# EAGLE schematic untitled (EAGLE 9.3.0)

## Sheet 1 of 4
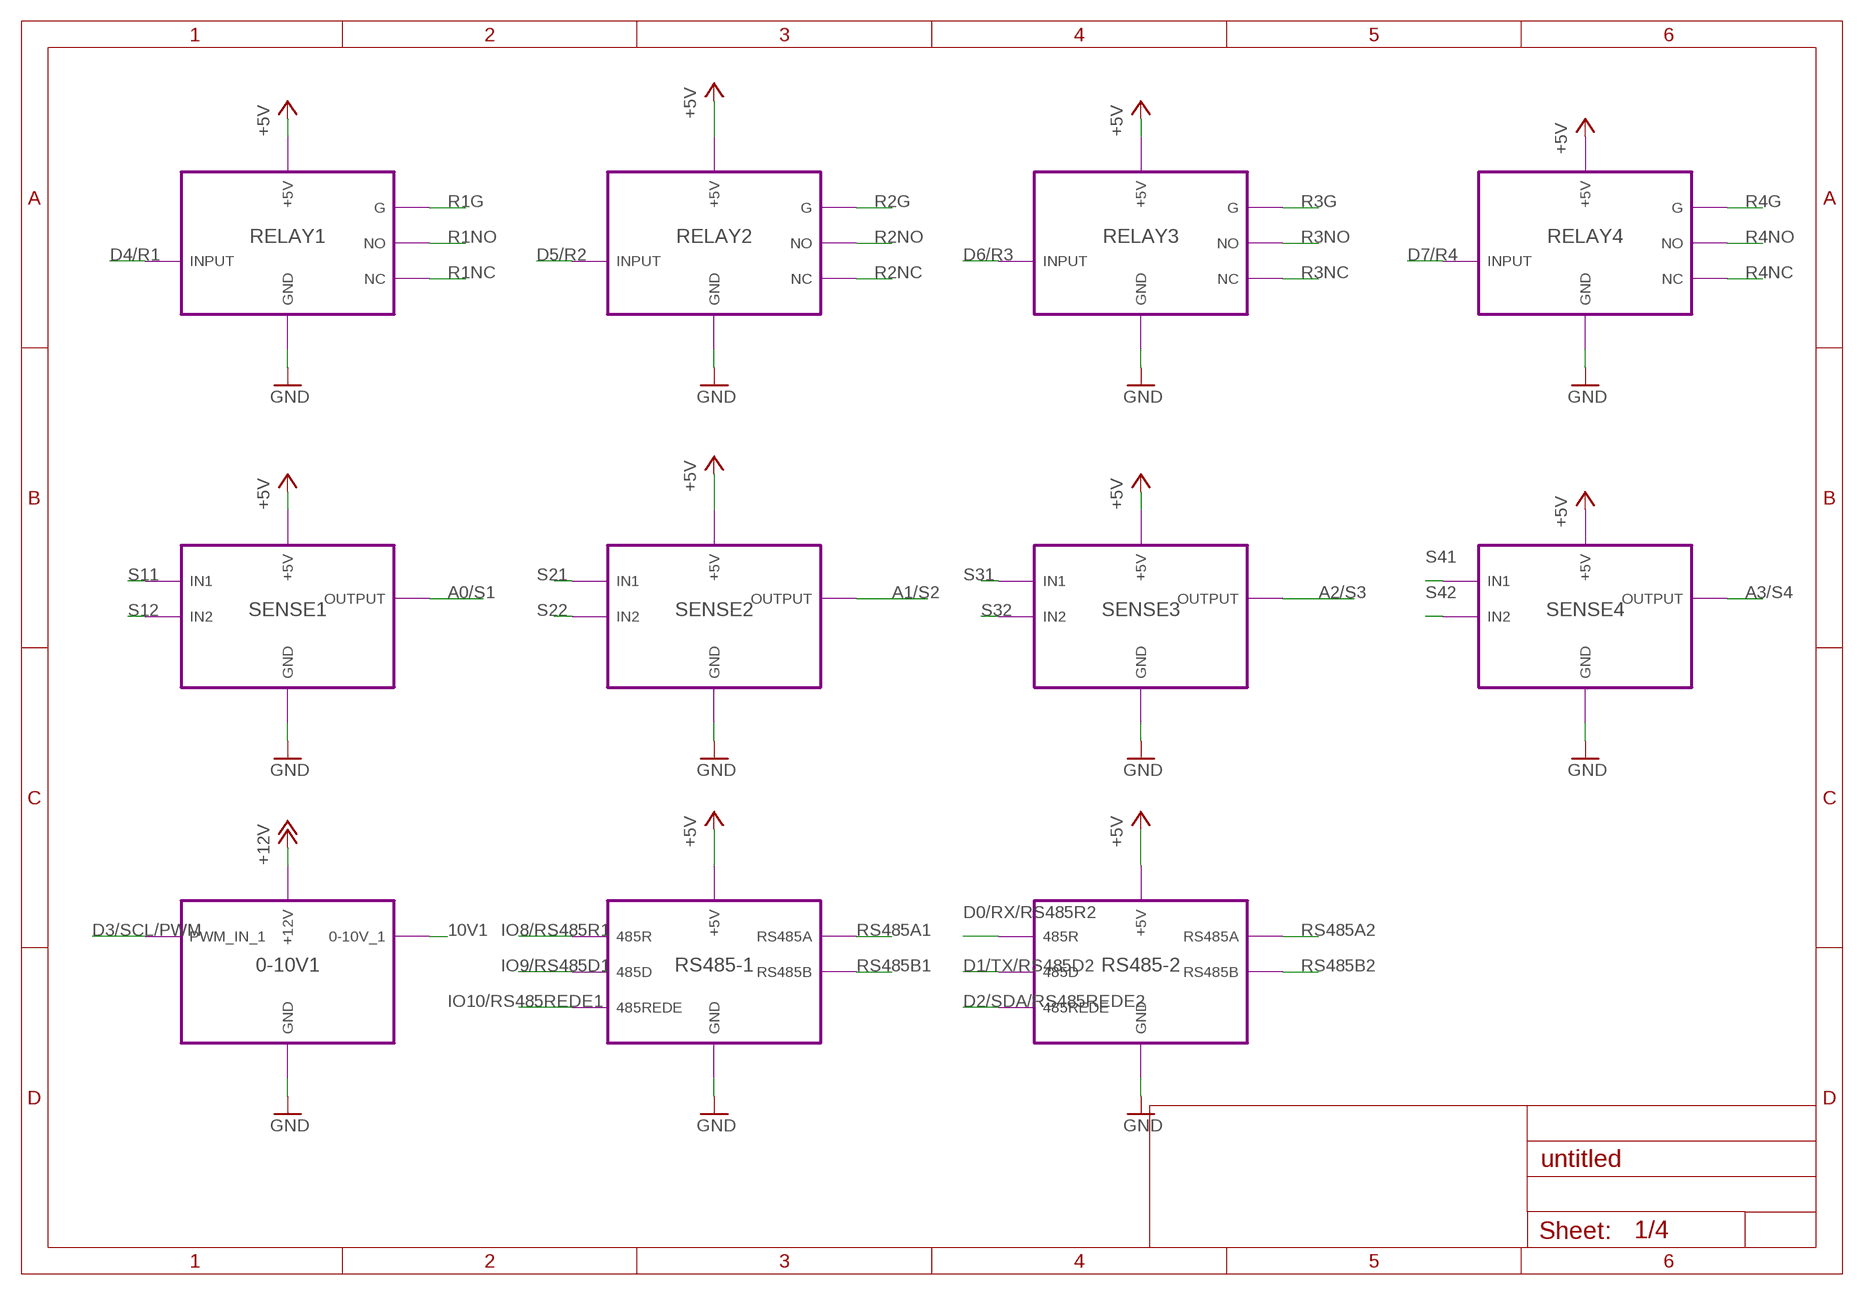
[diagram p0: schematic, sheet 1]

### Module instances
RELAY1 = RELAY (part numbers offset by 100)
RELAY2 = RELAY (part numbers offset by 200)
RELAY3 = RELAY (part numbers offset by 300)
RELAY4 = RELAY (part numbers offset by 400)
SENSE1 = SENSE (part numbers offset by 500)
SENSE2 = SENSE (part numbers offset by 600)
SENSE3 = SENSE (part numbers offset by 700)
SENSE4 = SENSE (part numbers offset by 800)
0-10V1 = 0-10V (part numbers offset by 900)
RS485-1 = RS485 (part numbers offset by 1000)
RS485-2 = RS485 (part numbers offset by 1100)

### Nets
10V1: port 0-10V1.0-10V_1 ; also sheet 4
+5V [power]: port RELAY1.+5V RELAY2.+5V RELAY3.+5V RELAY4.+5V SENSE1.+5V SENSE2.+5V SENSE3.+5V SENSE4.+5V RS485-1.+5V RS485-2.+5V ; also sheet 2,3,4
+12V [power]: port 0-10V1.+12V ; also sheet 3
A0/S1: port SENSE1.OUTPUT ; also sheet 2
A1/S2: port SENSE2.OUTPUT ; also sheet 2
A2/S3: port SENSE3.OUTPUT ; also sheet 2
A3/S4: port SENSE4.OUTPUT ; also sheet 2
D0/RX/RS485R2: port RS485-2.485R ; also sheet 2
D1/TX/RS485D2: port RS485-2.485D ; also sheet 2
D2/SDA/RS485REDE2: port RS485-2.485REDE ; also sheet 2
D3/SCL/PWM: port 0-10V1.PWM_IN_1 ; also sheet 2
D4/R1: port RELAY1.INPUT ; also sheet 2
D5/R2: port RELAY2.INPUT ; also sheet 2
D6/R3: port RELAY3.INPUT ; also sheet 2
D7/R4: port RELAY4.INPUT ; also sheet 2
GND [power]: port RELAY1.GND RELAY2.GND RELAY3.GND RELAY4.GND SENSE1.GND SENSE2.GND SENSE3.GND SENSE4.GND 0-10V1.GND RS485-1.GND RS485-2.GND ; also sheet 2,3,4
IO8/RS485R1: port RS485-1.485R ; also sheet 2
IO9/RS485D1: port RS485-1.485D ; also sheet 2
IO10/RS485REDE1: port RS485-1.485REDE ; also sheet 2
R1G [hipower]: port RELAY1.G ; also sheet 4
R1NC: port RELAY1.NC ; also sheet 4
R1NO [hipower]: port RELAY1.NO ; also sheet 4
R2G [hipower]: port RELAY2.G ; also sheet 4
R2NC [hipower]: port RELAY2.NC ; also sheet 4
R2NO [hipower]: port RELAY2.NO ; also sheet 4
R3G [hipower]: port RELAY3.G ; also sheet 4
R3NC [hipower]: port RELAY3.NC ; also sheet 4
R3NO [hipower]: port RELAY3.NO ; also sheet 4
R4G [hipower]: port RELAY4.G ; also sheet 4
R4NC [hipower]: port RELAY4.NC ; also sheet 4
R4NO [hipower]: port RELAY4.NO ; also sheet 4
RS485A1: port RS485-1.RS485A ; also sheet 4
RS485A2: port RS485-2.RS485A ; also sheet 4
RS485B1: port RS485-1.RS485B ; also sheet 4
RS485B2: port RS485-2.RS485B ; also sheet 4
S11: port SENSE1.IN1 ; also sheet 4
S12: port SENSE1.IN2 ; also sheet 4
S21: port SENSE2.IN1 ; also sheet 4
S22: port SENSE2.IN2 ; also sheet 4
S31: port SENSE3.IN1 ; also sheet 4
S32: port SENSE3.IN2 ; also sheet 4
S41: port SENSE4.IN1 ; also sheet 4
S42: port SENSE4.IN2 ; also sheet 4

## Sheet 2 of 4
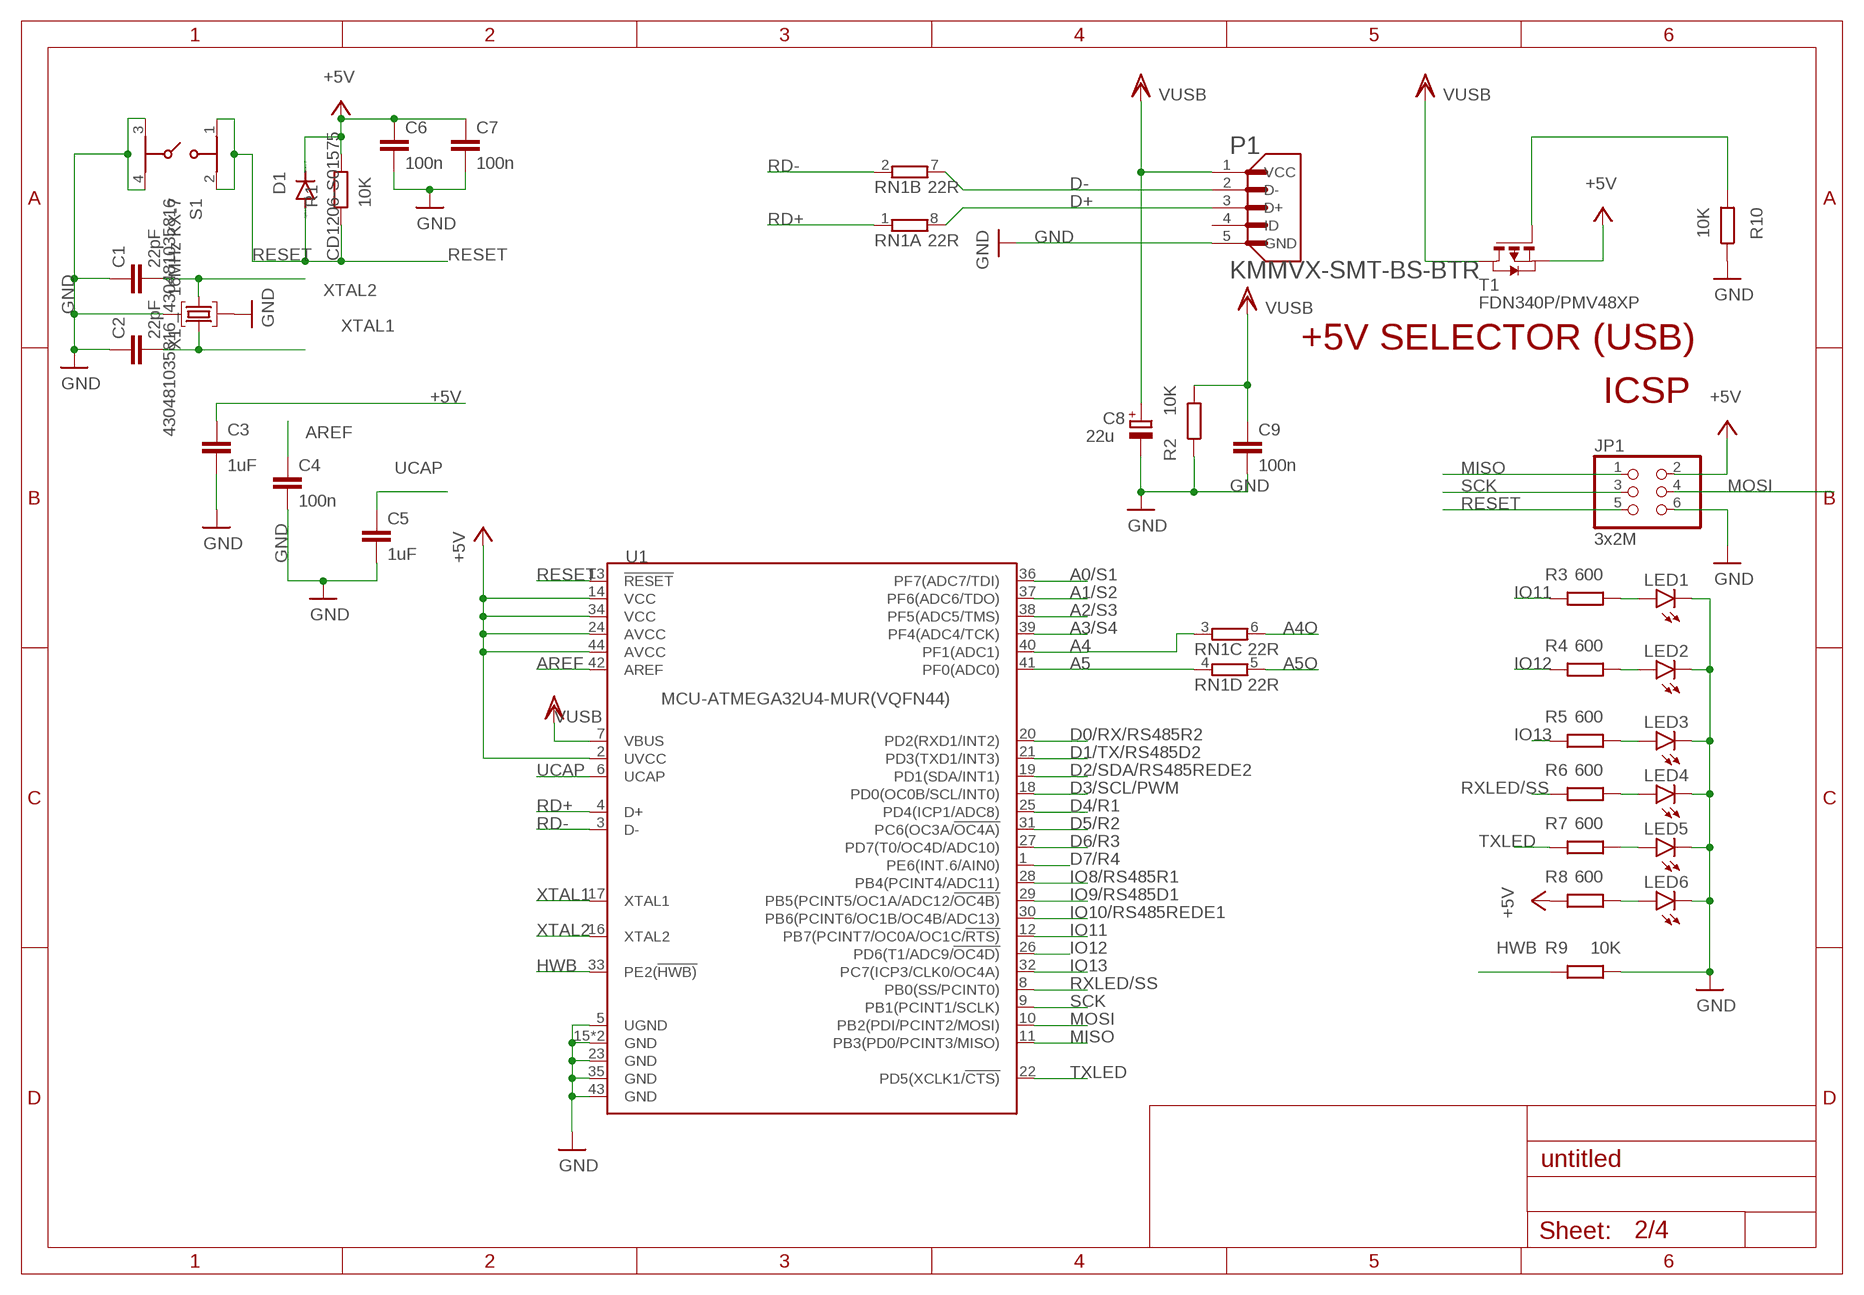
[diagram p1: schematic, sheet 2]

### Parts
C1  22pF  C-EUC0402  [C0402]
C2  22pF  C-EUC0402  [C0402]
C3  1uF  C-EUC0402  [C0402]
C4  100n  C-EUC0402  [C0402]
C5  1uF  C-EUC0402  [C0402]
C6  100n  C-EUC0402  [C0402]
C7  100n  C-EUC0402  [C0402]
C8  22u  CPOL-EUSMCB  [SMC_B]
C9  100n  C-EUC0402  [C0402]
D1  CD1206-S01575  DIODE-MINIMELF  [MINIMELF]
JP1  3x2M  PINHD-2X3  [2X03]
LED1  IN-S85AT5B  LEDCHIP-LED0805  [CHIP-LED0805]
LED2  IN-S85AT5B  LEDCHIP-LED0805  [CHIP-LED0805]
LED3  IN-S85AT5B  LEDCHIP-LED0805  [CHIP-LED0805]
LED4  IN-S85AT5B  LEDCHIP-LED0805  [CHIP-LED0805]
LED5  IN-S85AT5B  LEDCHIP-LED0805  [CHIP-LED0805]
LED6  IN-S85AT5B  LEDCHIP-LED0805  [CHIP-LED0805]
P1  KMMVX-SMT-BS-BTR  [KYCON_KMMVX-SMT-BS-BTR]
R1  10K  R-EU_R0402  [R0402]
R2  10K  R-EU_R0402  [R0402]
R3  600  R-EU_R0603  [R0603]
R4  600  R-EU_R0603  [R0603]
R5  600  R-EU_R0603  [R0603]
R6  600  R-EU_R0603  [R0603]
R7  600  R-EU_R0603  [R0603]
R8  600  R-EU_R0603  [R0603]
R9  10K  R-EU_R0402  [R0402]
R10  10K  R-EU_R0402  [R0402]
RN1  22R  4R-NCAY16  [CAY16]
S1  430481035816_430481035816  [430481035816]
T1  FDN340P/PMV48XP  PMOSSOT23  [SOT-23]
U1  MCU-ATMEGA32U4-MUR(VQFN44)  [QFN44G-0.5-7X7MM]
X1  16MHz KX-7  CRYSTAL-3.2-2.5  [CRYSTAL-3.2-2.5]

### Nets
+5V [power]: C3.1 C6.1 C7.1 D1.C JP1.2 R1.1 R8.1 T1.2(S) U1.2(UVCC) U1.14(VCC) U1.24(AVCC) U1.34(VCC) U1.44(AVCC) ; also sheet 1,3,4
A0/S1: U1.36(PF7(ADC7/TDI)) ; also sheet 1
A1/S2: U1.37(PF6(ADC6/TDO)) ; also sheet 1
A2/S3: U1.38(PF5(ADC5/TMS)) ; also sheet 1
A3/S4: U1.39(PF4(ADC4/TCK)) ; also sheet 1
A4: RN1.3 U1.40(PF1(ADC1))
A4O: RN1.6 ; also sheet 4
A5: RN1.4 U1.41(PF0(ADC0))
A5O: RN1.5 ; also sheet 4
AREF: C4.1 U1.42(AREF)
D0/RX/RS485R2: U1.20(PD2(RXD1/INT2)) ; also sheet 1
D1/TX/RS485D2: U1.21(PD3(TXD1/INT3)) ; also sheet 1
D2/SDA/RS485REDE2: U1.19(PD1(SDA/INT1)) ; also sheet 1
D3/SCL/PWM: U1.18(PD0(OC0B/SCL/INT0)) ; also sheet 1
D4/R1: U1.25(PD4(ICP1/ADC8)) ; also sheet 1
D5/R2: U1.31(PC6(OC3A/!OC4A)) ; also sheet 1
D6/R3: U1.27(PD7(T0/OC4D/ADC10)) ; also sheet 1
D7/R4: U1.1(PE6(INT.6/AIN0)) ; also sheet 1
D+: P1.3(D+) RN1.8
D-: P1.2(D-) RN1.7
GND [power]: C1.1 C2.1 C3.2 C4.2 C5.2 C6.2 C7.2 C8.- C9.2 JP1.6 LED1.C LED2.C LED3.C LED4.C LED5.C LED6.C P1.5(GND) R2.1 R9.2 R10.1 S1.3 S1.4 U1.5(UGND) U1.15(GND) U1.23(GND) U1.35(GND) U1.43(GND) U1.TAB(GND) X1.2(GND) X1.4(GND) ; also sheet 1,3,4
HWB: R9.1 U1.33(PE2(!HWB))
IO8/RS485R1: U1.28(PB4(PCINT4/ADC11)) ; also sheet 1
IO9/RS485D1: U1.29(PB5(PCINT5/OC1A/ADC12/!OC4B)) ; also sheet 1
IO10/RS485REDE1: U1.30(PB6(PCINT6/OC1B/OC4B/ADC13)) ; also sheet 1
IO11: R3.1 U1.12(PB7(PCINT7/OC0A/OC1C/!RTS)) ; also sheet 4
IO12: R4.1 U1.26(PD6(T1/ADC9/!OC4D)) ; also sheet 4
IO13: R5.1 U1.32(PC7(ICP3/CLK0/OC4A))
MISO: JP1.1 U1.11(PB3(PD0/PCINT3/MISO))
MOSI: JP1.4 U1.10(PB2(PDI/PCINT2/MOSI))
N$4: LED3.A R5.2
N$5: LED4.A R6.2
N$6: LED5.A R7.2
N$9: LED6.A R8.2
N$10: R10.2 T1.3(G)
N$16: LED2.A R4.2
N$17: LED1.A R3.2
RD+: RN1.1 U1.4(D+)
RD-: RN1.2 U1.3(D-)
RESET: D1.A JP1.5 R1.2 S1.1 S1.2 U1.13(!RESET)
RXLED/SS: R6.1 U1.8(PB0(SS/PCINT0))
SCK: JP1.3 U1.9(PB1(PCINT1/SCLK))
TXLED: R7.1 U1.22(PD5(XCLK1/!CTS))
UCAP: C5.1 U1.6(UCAP)
VUSB: C8.+ C9.1 P1.1(VCC) R2.2 T1.1(D) U1.7(VBUS) ; supply symbol labelled VDD
XTAL1: C2.2 U1.17(XTAL1) X1.3(C2)
XTAL2: C1.2 U1.16(XTAL2) X1.1(C1)
Unconnected: P1.4(ID)

### Notes on the sheet
- +5V SELECTOR (USB)
- ICSP

## Sheet 3 of 4
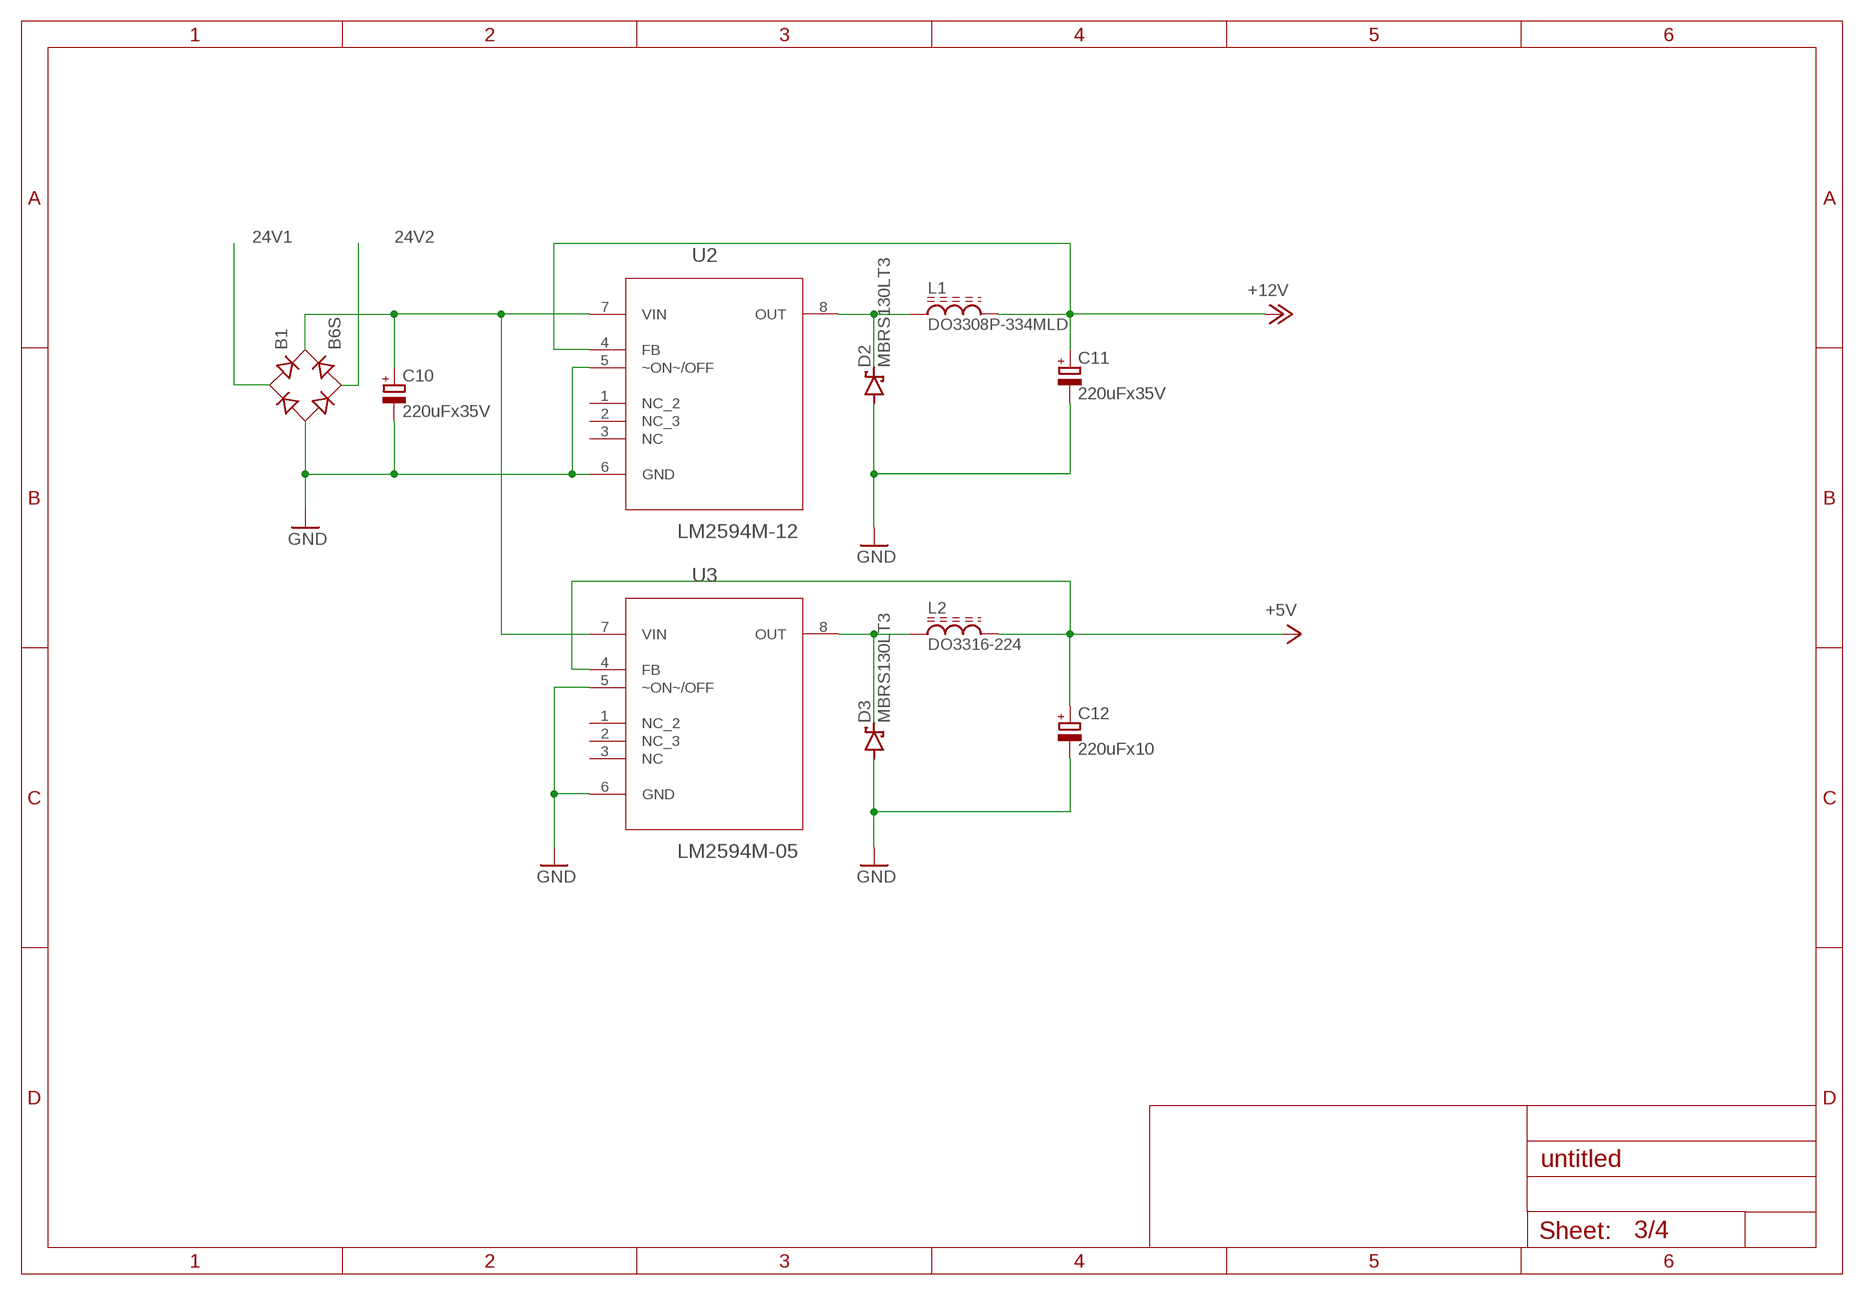
[diagram p2: schematic, sheet 3]

### Parts
B1  B6S  [MBS]
C10  220uFx35V  CPOL-EUUD-10X10  [UD-10X10_NICHICON]
C11  220uFx35V  CPOL-EUUD-10X10  [UD-10X10_NICHICON]
C12  220uFx10  CPOL-EUUD-6,3X8,8  [UD-6,3X5,8_NICHICON]
D2  MBRS130LT3  [SMB]
D3  MBRS130LT3  [SMB]
L1  DO3308P-334MLD  US_BOURNS_SRR0805-101K  [BOURNS_SRR0805]
L2  DO3316-224  US_BOURNS_SRR0805-101K  [BOURNS_SRR0805]
U2  LM2594M-12  [SOIC127P620X175-8N]
U3  LM2594M-05  LM2594M-12  [SOIC127P620X175-8N]

### Nets
24V1 [power]: B1.AC1 ; also sheet 4
24V2 [power]: B1.AC2 ; also sheet 4
+5V [power]: C12.+ L2.2 U3.4(FB) ; also sheet 1,2,4
+12V [power]: C11.+ L1.2 U2.4(FB) ; also sheet 1
GND [power]: B1.- C10.- C11.- C12.- D2.A D3.A U2.5(~ON~/OFF) U2.6(GND) U3.5(~ON~/OFF) U3.6(GND) ; also sheet 1,2,4
N$1 [power]: B1.+ C10.+ U2.7(VIN) U3.7(VIN)
N$2: D2.C L1.1 U2.8(OUT)
N$8: D3.C L2.1 U3.8(OUT)
Unconnected: U2.1(NC_2) U2.2(NC_3) U2.3(NC) U3.1(NC_2) U3.2(NC_3) U3.3(NC)

## Sheet 4 of 4
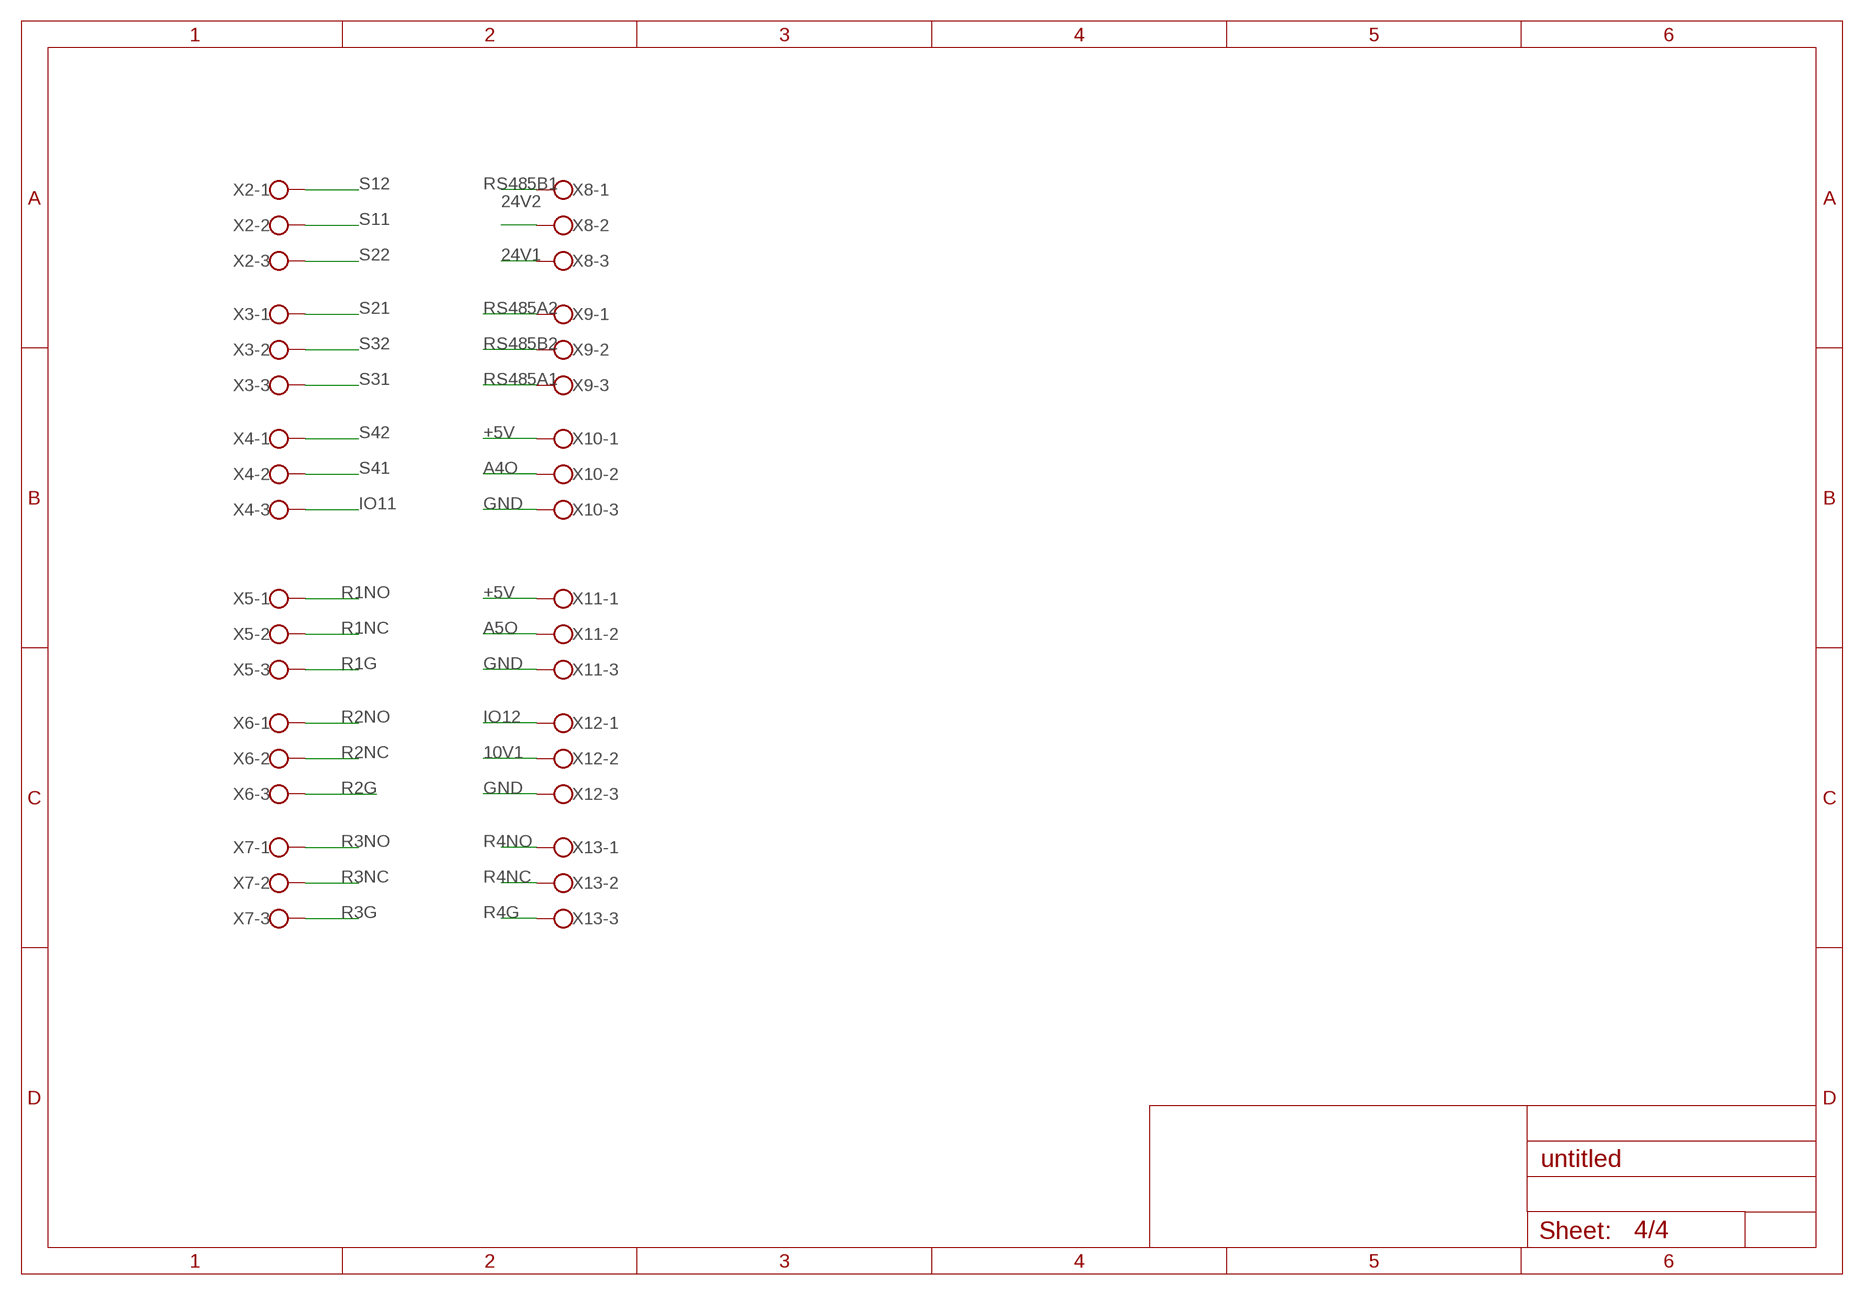
[diagram p3: schematic, sheet 4]

### Parts
X2  W237-103  [W237-103]
X3  W237-103  [W237-103]
X4  W237-103  [W237-103]
X5  W237-103  [W237-103]
X6  W237-103  [W237-103]
X7  W237-103  [W237-103]
X8  W237-103  [W237-103]
X9  W237-103  [W237-103]
X10  W237-103  [W237-103]
X11  W237-103  [W237-103]
X12  W237-103  [W237-103]
X13  W237-103  [W237-103]

### Nets
10V1: X12.2 ; also sheet 1
24V1 [power]: X8.3 ; also sheet 3
24V2 [power]: X8.2 ; also sheet 3
+5V [power]: X10.1 X11.1 ; also sheet 1,2,3
A4O: X10.2 ; also sheet 2
A5O: X11.2 ; also sheet 2
GND [power]: X10.3 X11.3 X12.3 ; also sheet 1,2,3
IO11: X4.3 ; also sheet 2
IO12: X12.1 ; also sheet 2
R1G [hipower]: X5.3 ; also sheet 1
R1NC: X5.2 ; also sheet 1
R1NO [hipower]: X5.1 ; also sheet 1
R2G [hipower]: X6.3 ; also sheet 1
R2NC [hipower]: X6.2 ; also sheet 1
R2NO [hipower]: X6.1 ; also sheet 1
R3G [hipower]: X7.3 ; also sheet 1
R3NC [hipower]: X7.2 ; also sheet 1
R3NO [hipower]: X7.1 ; also sheet 1
R4G [hipower]: X13.3 ; also sheet 1
R4NC [hipower]: X13.2 ; also sheet 1
R4NO [hipower]: X13.1 ; also sheet 1
RS485A1: X9.3 ; also sheet 1
RS485A2: X9.1 ; also sheet 1
RS485B1: X8.1 ; also sheet 1
RS485B2: X9.2 ; also sheet 1
S11: X2.2 ; also sheet 1
S12: X2.1 ; also sheet 1
S21: X3.1 ; also sheet 1
S22: X2.3 ; also sheet 1
S31: X3.3 ; also sheet 1
S32: X3.2 ; also sheet 1
S41: X4.2 ; also sheet 1
S42: X4.1 ; also sheet 1

## Library data of the parts
B1 = rectifier:B*S: Surface Mount Glass Passivated Bridge Rectifiers Source: Comchip Bridge Rectifiers B05S-G_B10S-G.pdf
C1-C7 C9 = rcl:C-EU: CAPACITOR, European symbol; SPICEPREFIX: C
C8 C12 = rcl:CPOL-EU: POLARIZED CAPACITOR, European symbol; SPICEPREFIX: C
C10 C11 = rcl:CPOL-EU: POLARIZED CAPACITOR, European symbol; MODEL: UWT1V101MCL1GS; SPICEPREFIX: C
D1 = diode:DIODE-: DIODE
D2 D3 = diode:MBRS130LT3: Schottky Power Rectifier Source: http://www.onsemi.com/pub/Collateral/MBRS130LT3-D.PDF
JP1 = gen_comp:PINHD-2X3: PIN HEADER
L1 L2 = _hhn_inductors_bournsSRR0805:US_BOURNS_SRR0805-*: BOURNS SRR0805 Series: Shielded Power Inductors (Ferrite) Bourns Part-No. using 3-digit inductance coding following MIL Std 39008: SRR0805-iiiM|Y|K iii Inductance in uH (e.g. 2R2 = 2,2uH, 100 = 10uH, 101 = 100uH; 102 = 1000uH) M|Y|K Tolerance; Y: ±20% | M: ±15% | K: ±10%
LED1-LED6 = led:LED: LED OSRAM: - CHIPLED LG R971, LG N971, LY N971, LG Q971, LY Q971, LO R971, LY R971 LH N974, LH R974 LS Q976, LO Q976, LY Q976 LO Q996 - Hyper CHIPLED LW Q18S LB Q993, LB Q99A, LB R99A - SideLED LS A670, LO A670, LY A670, LG A670, LP A670 LB A673, LV A673, LT A673, LW A673 LH A674 LY A675 LS A676, LA A676, LO A676, LY A676, LW A676 LS A679, LY A679, LG A679 - Hyper Micro SIDELED® LS Y876, LA Y876, LO Y876, LY Y876 LT Y87S - SmartLED LW L88C, LW L88S LB L89C, LB L89S, LG L890 LS L89K, LO L89K, LY L89K LS L896, LA L896, LO L896, LY L896 - TOPLED LS T670, LO T670, LY T670, LG T670, LP T670 LSG T670, LSP T670, LSY T670, LOP T670, LYG T670 LG T671, LOG T671, LSG T671 LB T673, LV T673, LT T673, LW T673 LH T674 LS T676, LA T676, LO T676, LY T676, LB T676, LH T676, LSB T676, LW T676 LB T67C, LV T67C, LT T67C, LS T67K, LO T67K, LY T67K, LW E67C LS E67B, LA E67B, LO E67B, LY E67B, LB E67C, LV E67C, LT E67C LW T67C LS T679, LY T679, LG T679 LS T770, LO T770, LY T770, LG T770, LP T770 LB T773, LV T773, LT T773, LW T773 LH T774 LS E675, LA E675, LY E675, LS T675 LS T776, LA T776, LO T776, LY T776, LB T776 LHGB T686 LT T68C, LB T68C - Hyper Mini TOPLED® LB M676 - Mini TOPLED Santana® LG M470 LS M47K, LO M47K, LY M47K Source: http://www.osram.convergy.de LUXEON: - LUMILED® LXK2-PW12-R00, LXK2-PW12-S00, LXK2-PW14-U00, LXK2-PW14-V00 LXK2-PM12-R00, LXK2-PM12-S00, LXK2-PM14-U00 LXK2-PE12-Q00, LXK2-PE12-R00, LXK2-PE12-S00, LXK2-PE14-T00, LXK2-PE14-U00 LXK2-PB12-K00, LXK2-PB12-L00, LXK2-PB12-M00, LXK2-PB14-N00, LXK2-PB14-P00, LXK2-PB14-Q00 LXK2-PR12-L00, LXK2-PR12-M00, LXK2-PR14-Q00, LXK2-PR14-R00 LXK2-PD12-Q00, LXK2-PD12-R00, LXK2-PD12-S00 LXK2-PH12-R00, LXK2-PH12-S00 LXK2-PL12-P00, LXK2-PL12-Q00, LXK2-PL12-R00 Source: www.luxeon.com KINGBRIGHT: KA-3528ASYC Source: www.kingbright.com
P1 = KMMVX-SMT-BS-BTR:KMMVX-SMT-BS-BTR: Micro-B Socket, USB 2.0 SMT; AVAILABILITY: Unavailable; DESCRIPTION: Conn Micro USB Type B SKT 5 POS 0.65mm Solder ST SMD 5 Terminal 1Port T/R; MF: Kycon; MP: KMMVX-SMT-BS-BTR; PACKAGE: None; PRICE: None
R1-R10 = rcl:R-EU_: RESISTOR, European symbol; SPICEPREFIX: R
RN1 = resistor-dil:4R-N: Array Chip Resistor Source: RS Component / Phycomp
S1 = 430481035816:430481035816: WS-TASV 6x6mm washable Tact Switch, SMD version Specification Rating:50mA, 12VDC Contact Resistance Initial:100mΩ max. After life test: 20mΩ max. Insulation Resistance: min.100MΩ at 500VDC Dielectric Strength : 250VAC for 1 minute Stroke: :0.25 + 0.2 mm / - 0.1 mm Bounce:10ms max. Material Cover : : Stainless Steel Stem: LCP UL 94V-0 Frame: LCP UL 94V-0, color Black Contact: Stainless Steel with silver Terminal: Brass with silver plating Tape: Polyimide tape <http://katalog.we-online.de/media/images/v2/Family_WS-TASV_SMD_Tact_Switch_6x6mm_4304810xx8xx.jpg> Details see: http://katalog.we-online.de/em/datasheet/4304x1xxx8x6.pdf 2016 (C) Wurth Elektronik; AVAILABILITY: Unavailable; DESCRIPTION: Switch Tactile Spst-no 0.05A 12V; MF: Wurth Electronics; MP: 430481035816; PACKAGE: None; PRICE: None
T1 = zetex:PMOSSOT23: MOS FET
U1 = MCU-ATMEGA32U4-MUR_VQFN44_:MCU-ATMEGA32U4-MUR(VQFN44): 310010016; AVAILABILITY: Unavailable; DESCRIPTION: ATmega Series 32 KB Flash 2.5 KB SRAM 16 MHz 8-Bit Microcontroller - MLF/QFN-44; MF: Microchip; MP: ATMEGA32U4-MUR; PACKAGE: QFN-44 Microchip; PRICE: None
U2 U3 = LM2594M-12:LM2594M-12: SIMPLE SWITCHER; AVAILABILITY: Unavailable; DESCRIPTION: SIMPLE SWITCHER Power Converter 150 KHz 0.5A Step-Down Voltage Regulator 8-SOIC -40 to 125; MF: Texas Instruments; MP: LM2594M-12; PACKAGE: SOIC-8 Texas Instruments; PRICE: None
X1 = gen_comp:CRYSTAL-3.2-2.5
X2-X13 = con-wago-500:W237-103: WAGO SCREW CLAMP; MPN: 237-103; OC_FARNELL: unknown; OC_NEWARK: 18M7116

## Module RELAY
Ports: INPUT(in) GND(pwr) +5V(pwr) G(io) NO(io) NC(io)
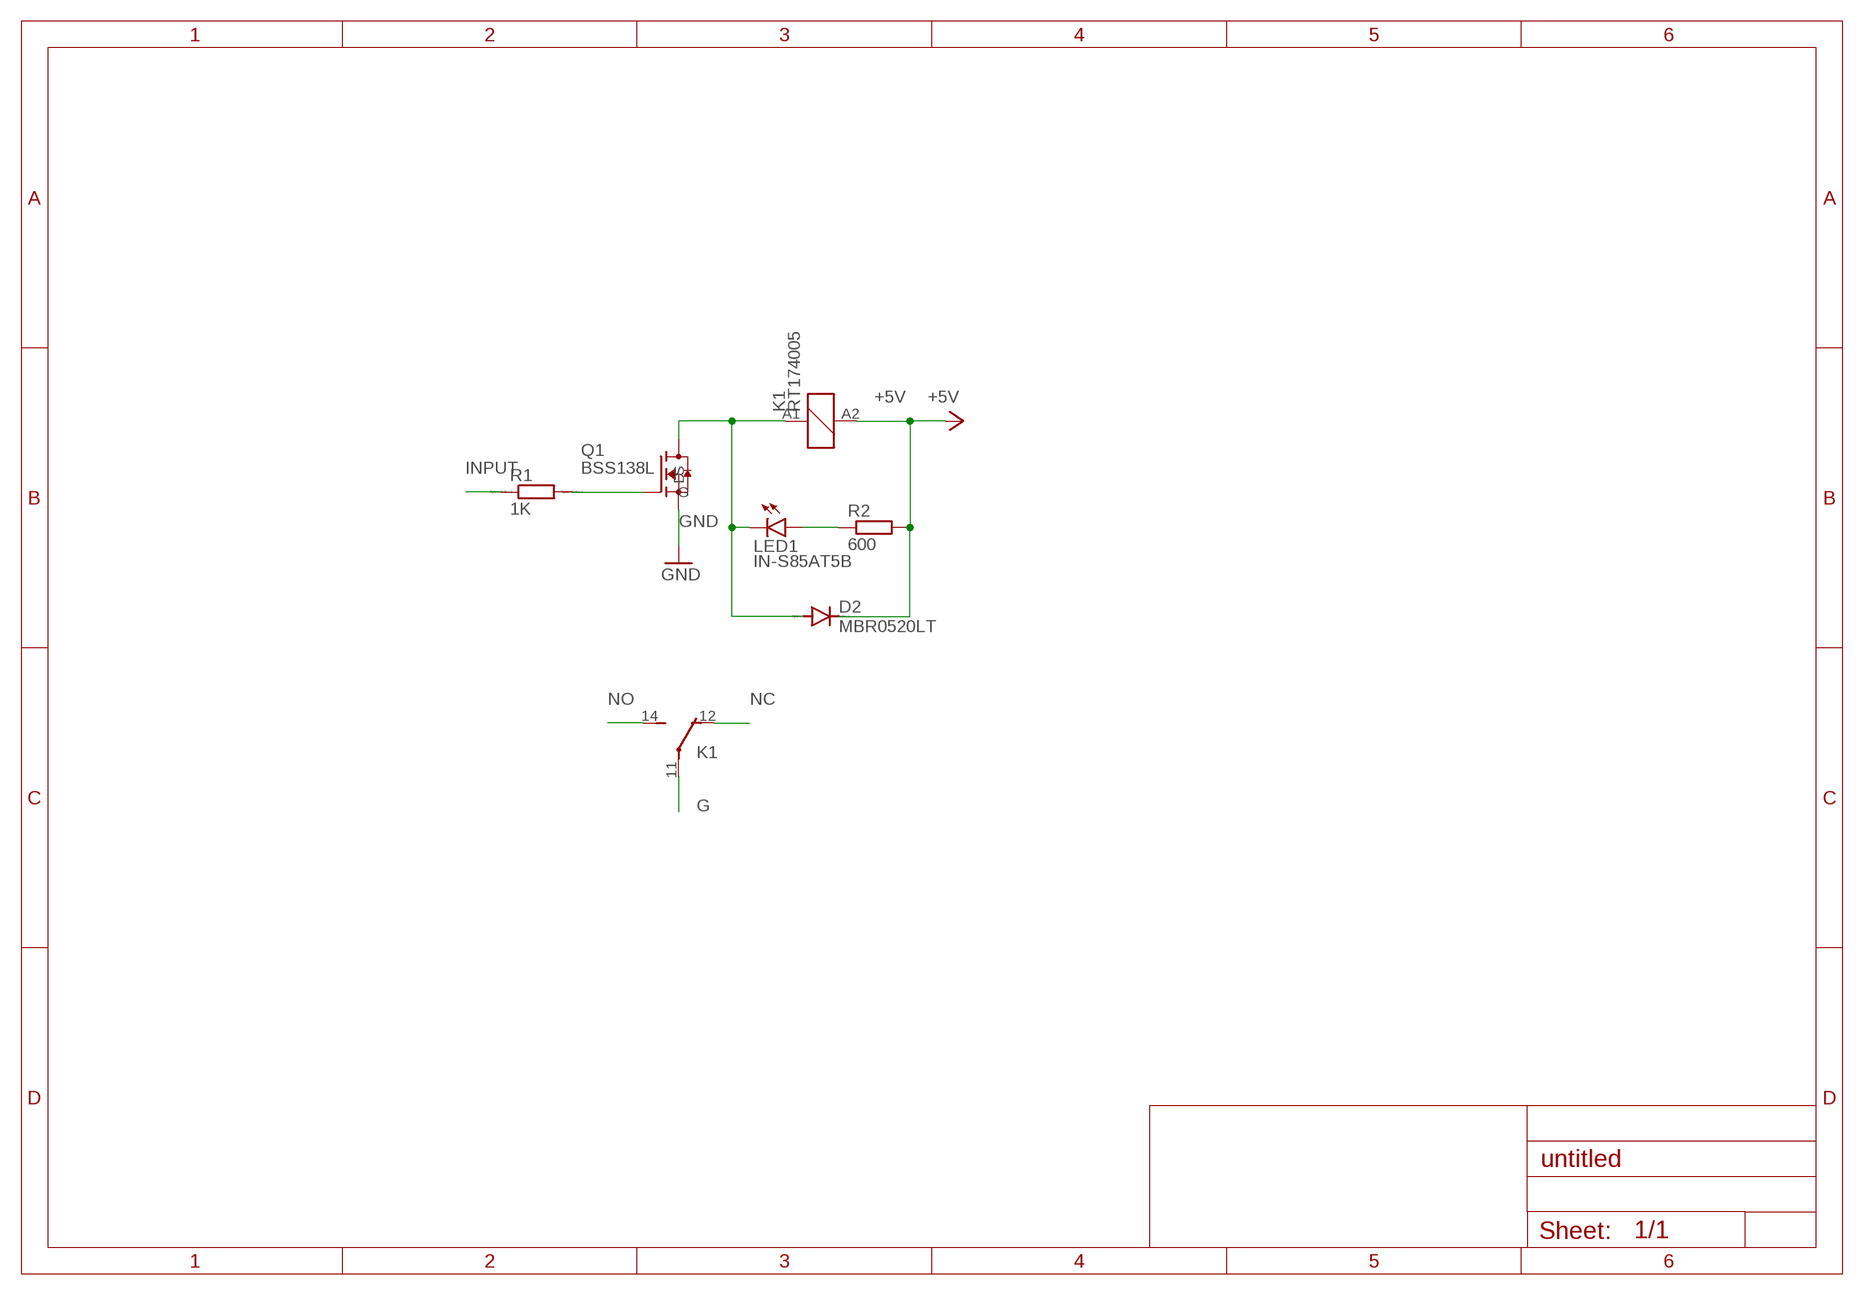
[diagram p4: schematic, module RELAY, sheet 1]

### Parts
D2  MBR0520LT  [SOD123]
K1  RT174005  [RT-C/O12A3.5]
LED1  IN-S85AT5B  LEDCHIP-LED0805  [CHIP-LED0805]
Q1  BSS138L  [BSS138L]
R1  1K  RR0603  [R0603]
R2  600  R-EU_R0603  [R0603]

### Nets
+5V: D2.C K1.A2 R2.2
G: K1.11(2:P)
GND: Q1.S
INPUT: R1.1
N$1: D2.A K1.A1 LED1.C Q1.D
N$2: LED1.A R2.1
N$4: Q1.G R1.2
NC: K1.12(2:O)
NO: K1.14(2:S)

### Library data of the parts
D2 = diode:MBR0520LT: SCHOTTKY BARRIER RECTIFIER Source: http://onsemi.com .. MBR0520LT1-D.pdf
K1 = relay:RT174*: Power PCB Relay SCHRACK sensitive 1 pole 10 A, highly sensitive version Source: http://www.schrack.com/.. 5822.pdf; MPN: RT174005; OC_FARNELL: unknown; OC_NEWARK: 48M7931
LED1 = led:LED: LED OSRAM: - CHIPLED LG R971, LG N971, LY N971, LG Q971, LY Q971, LO R971, LY R971 LH N974, LH R974 LS Q976, LO Q976, LY Q976 LO Q996 - Hyper CHIPLED LW Q18S LB Q993, LB Q99A, LB R99A - SideLED LS A670, LO A670, LY A670, LG A670, LP A670 LB A673, LV A673, LT A673, LW A673 LH A674 LY A675 LS A676, LA A676, LO A676, LY A676, LW A676 LS A679, LY A679, LG A679 - Hyper Micro SIDELED® LS Y876, LA Y876, LO Y876, LY Y876 LT Y87S - SmartLED LW L88C, LW L88S LB L89C, LB L89S, LG L890 LS L89K, LO L89K, LY L89K LS L896, LA L896, LO L896, LY L896 - TOPLED LS T670, LO T670, LY T670, LG T670, LP T670 LSG T670, LSP T670, LSY T670, LOP T670, LYG T670 LG T671, LOG T671, LSG T671 LB T673, LV T673, LT T673, LW T673 LH T674 LS T676, LA T676, LO T676, LY T676, LB T676, LH T676, LSB T676, LW T676 LB T67C, LV T67C, LT T67C, LS T67K, LO T67K, LY T67K, LW E67C LS E67B, LA E67B, LO E67B, LY E67B, LB E67C, LV E67C, LT E67C LW T67C LS T679, LY T679, LG T679 LS T770, LO T770, LY T770, LG T770, LP T770 LB T773, LV T773, LT T773, LW T773 LH T774 LS E675, LA E675, LY E675, LS T675 LS T776, LA T776, LO T776, LY T776, LB T776 LHGB T686 LT T68C, LB T68C - Hyper Mini TOPLED® LB M676 - Mini TOPLED Santana® LG M470 LS M47K, LO M47K, LY M47K Source: http://www.osram.convergy.de LUXEON: - LUMILED® LXK2-PW12-R00, LXK2-PW12-S00, LXK2-PW14-U00, LXK2-PW14-V00 LXK2-PM12-R00, LXK2-PM12-S00, LXK2-PM14-U00 LXK2-PE12-Q00, LXK2-PE12-R00, LXK2-PE12-S00, LXK2-PE14-T00, LXK2-PE14-U00 LXK2-PB12-K00, LXK2-PB12-L00, LXK2-PB12-M00, LXK2-PB14-N00, LXK2-PB14-P00, LXK2-PB14-Q00 LXK2-PR12-L00, LXK2-PR12-M00, LXK2-PR14-Q00, LXK2-PR14-R00 LXK2-PD12-Q00, LXK2-PD12-R00, LXK2-PD12-S00 LXK2-PH12-R00, LXK2-PH12-S00 LXK2-PL12-P00, LXK2-PL12-Q00, LXK2-PL12-R00 Source: www.luxeon.com KINGBRIGHT: KA-3528ASYC Source: www.kingbright.com
Q1 = BSS138L:BSS138L: BSS138L N-Channel Logic Level Enhancement Mode Field Effect Transistor; AVAILABILITY: Unavailable; DESCRIPTION: Small Signal MOSFET 50V 200mA 3.5 Ohm Single N-Channel SOT-23 Logic Level; MF: ON Semiconductor; MP: BSS138L; PACKAGE: SOT-23 ON Semiconductor; PRICE: None
R1 = eagle-ltspice:R: RESISTOR, European symbol; SPICEMODEL: NONE; SPICEPREFIX: R
R2 = rcl:R-EU_: RESISTOR, European symbol; SPICEPREFIX: R

## Module SENSE
Ports: IN1(in) IN2(in) +5V(pwr) GND(pwr) OUTPUT(out)
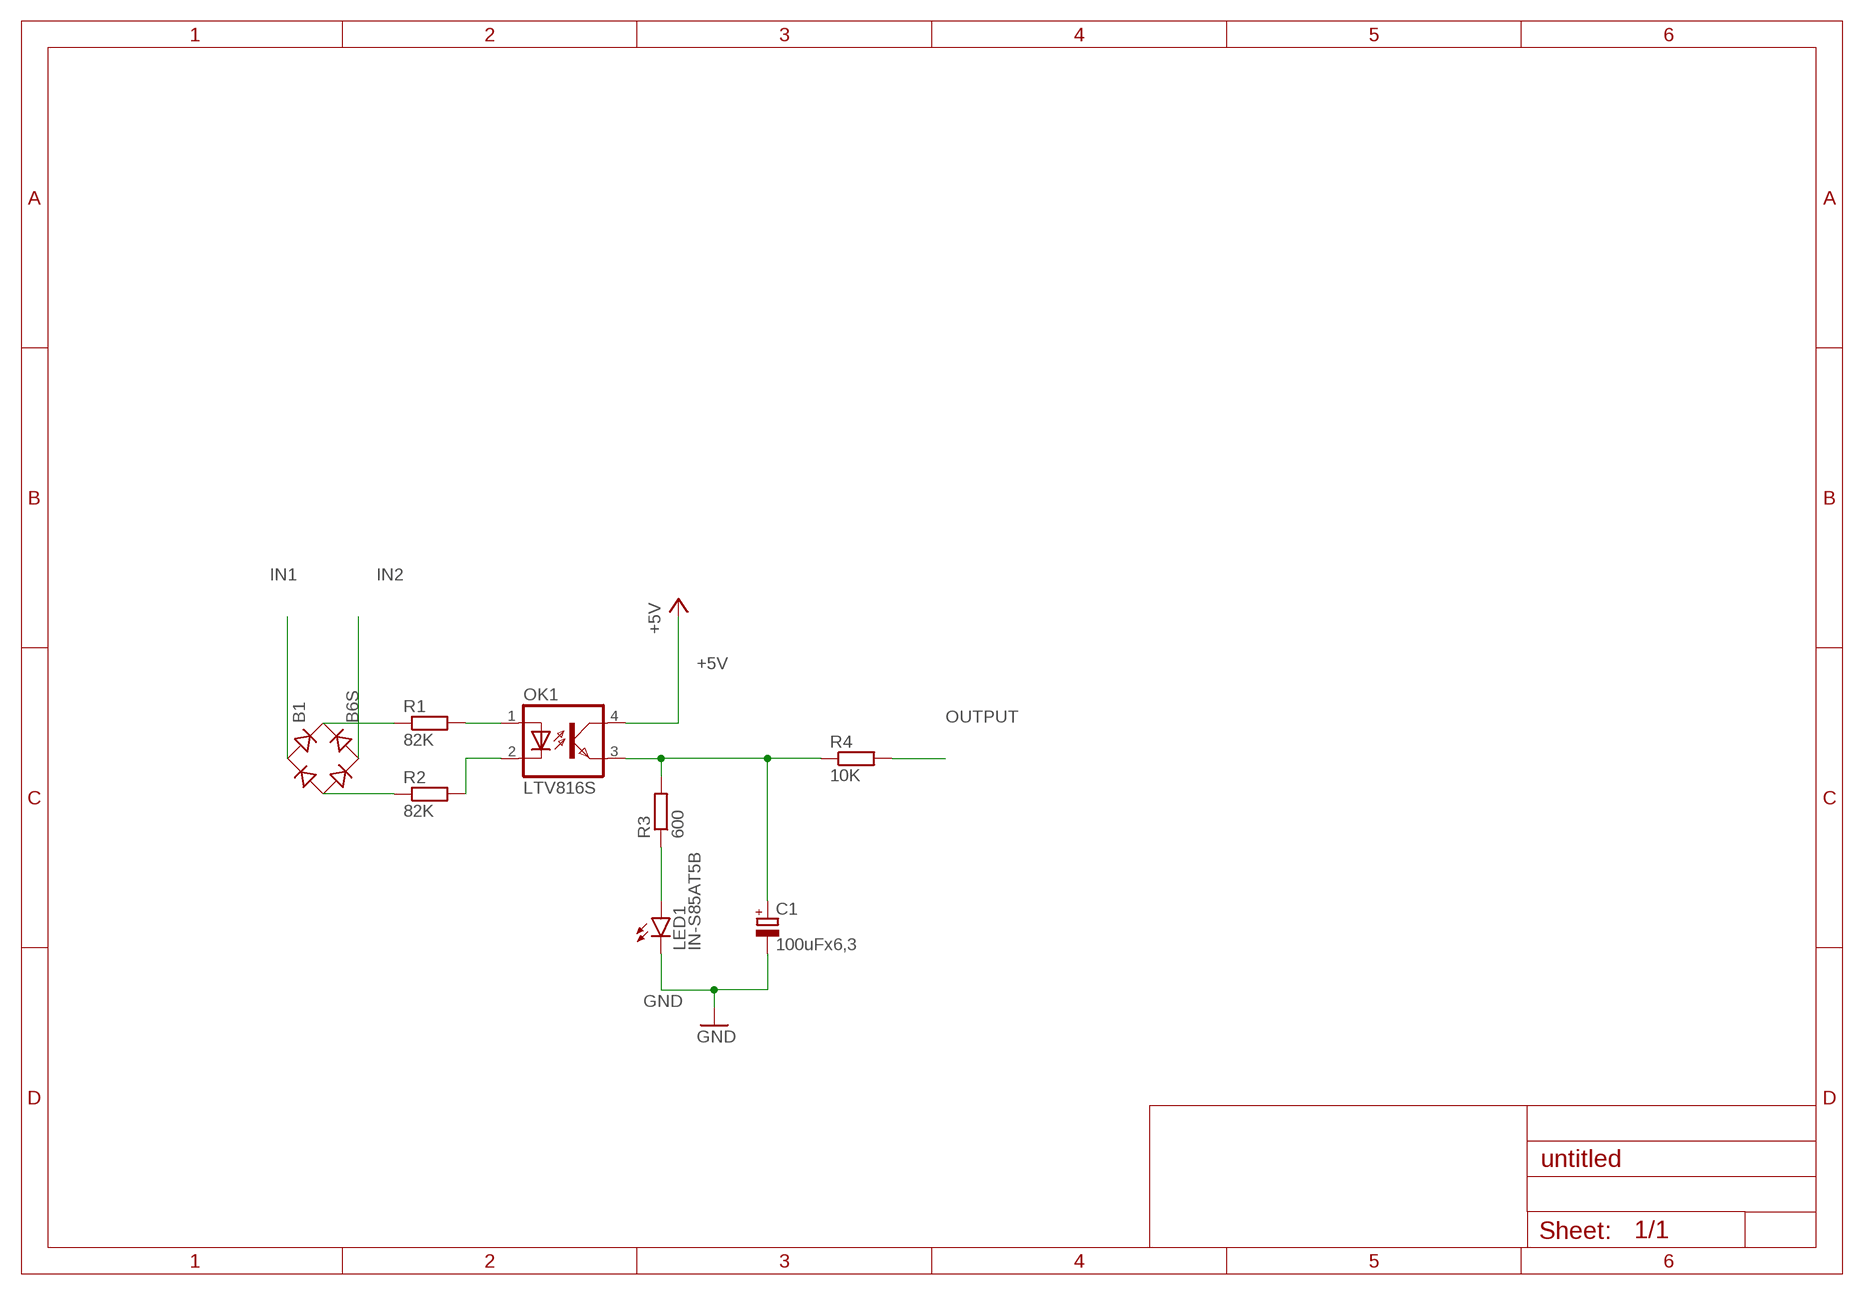
[diagram p5: schematic, module SENSE, sheet 1]

### Parts
B1  B6S  [MBS]
C1  100uFx6,3  CPOL-EUUD-6,3X8,8  [UD-6,3X5,8_NICHICON]
LED1  IN-S85AT5B  LEDCHIP-LED0805  [CHIP-LED0805]
OK1  LTV816S  [SMD4]
R1  82K  R-EU_R1206  [R1206]
R2  82K  R-EU_R1206  [R1206]
R3  600  R-EU_R0603  [R0603]
R4  10K  R-EU_R0402  [R0402]

### Nets
+5V: OK1.4(COL)
GND: C1.- LED1.C
IN1: B1.AC1
IN2: B1.AC2
N$2: LED1.A R3.1
N$3: B1.+ R1.1
N$4: OK1.1(A) R1.2
N$5: OK1.2(C) R2.2
N$6: B1.- R2.1
N$10: C1.+ OK1.3(EMIT) R3.2 R4.1
OUTPUT: R4.2

### Library data of the parts
B1 = rectifier:B*S: Surface Mount Glass Passivated Bridge Rectifiers Source: Comchip Bridge Rectifiers B05S-G_B10S-G.pdf
C1 = rcl:CPOL-EU: POLARIZED CAPACITOR, European symbol; SPICEPREFIX: C
LED1 = led:LED: LED OSRAM: - CHIPLED LG R971, LG N971, LY N971, LG Q971, LY Q971, LO R971, LY R971 LH N974, LH R974 LS Q976, LO Q976, LY Q976 LO Q996 - Hyper CHIPLED LW Q18S LB Q993, LB Q99A, LB R99A - SideLED LS A670, LO A670, LY A670, LG A670, LP A670 LB A673, LV A673, LT A673, LW A673 LH A674 LY A675 LS A676, LA A676, LO A676, LY A676, LW A676 LS A679, LY A679, LG A679 - Hyper Micro SIDELED® LS Y876, LA Y876, LO Y876, LY Y876 LT Y87S - SmartLED LW L88C, LW L88S LB L89C, LB L89S, LG L890 LS L89K, LO L89K, LY L89K LS L896, LA L896, LO L896, LY L896 - TOPLED LS T670, LO T670, LY T670, LG T670, LP T670 LSG T670, LSP T670, LSY T670, LOP T670, LYG T670 LG T671, LOG T671, LSG T671 LB T673, LV T673, LT T673, LW T673 LH T674 LS T676, LA T676, LO T676, LY T676, LB T676, LH T676, LSB T676, LW T676 LB T67C, LV T67C, LT T67C, LS T67K, LO T67K, LY T67K, LW E67C LS E67B, LA E67B, LO E67B, LY E67B, LB E67C, LV E67C, LT E67C LW T67C LS T679, LY T679, LG T679 LS T770, LO T770, LY T770, LG T770, LP T770 LB T773, LV T773, LT T773, LW T773 LH T774 LS E675, LA E675, LY E675, LS T675 LS T776, LA T776, LO T776, LY T776, LB T776 LHGB T686 LT T68C, LB T68C - Hyper Mini TOPLED® LB M676 - Mini TOPLED Santana® LG M470 LS M47K, LO M47K, LY M47K Source: http://www.osram.convergy.de LUXEON: - LUMILED® LXK2-PW12-R00, LXK2-PW12-S00, LXK2-PW14-U00, LXK2-PW14-V00 LXK2-PM12-R00, LXK2-PM12-S00, LXK2-PM14-U00 LXK2-PE12-Q00, LXK2-PE12-R00, LXK2-PE12-S00, LXK2-PE14-T00, LXK2-PE14-U00 LXK2-PB12-K00, LXK2-PB12-L00, LXK2-PB12-M00, LXK2-PB14-N00, LXK2-PB14-P00, LXK2-PB14-Q00 LXK2-PR12-L00, LXK2-PR12-M00, LXK2-PR14-Q00, LXK2-PR14-R00 LXK2-PD12-Q00, LXK2-PD12-R00, LXK2-PD12-S00 LXK2-PH12-R00, LXK2-PH12-S00 LXK2-PL12-P00, LXK2-PL12-Q00, LXK2-PL12-R00 Source: www.luxeon.com KINGBRIGHT: KA-3528ASYC Source: www.kingbright.com
OK1 = optocoupler-3-jcn:LTV816: OPTO COUPLER Source: LITEON, LTV816.pdf
R1-R4 = rcl:R-EU_: RESISTOR, European symbol; SPICEPREFIX: R

## Module 0-10V
Ports: PWM_IN_1(in) +12V(pwr) GND(pwr) 0-10V_1(out)
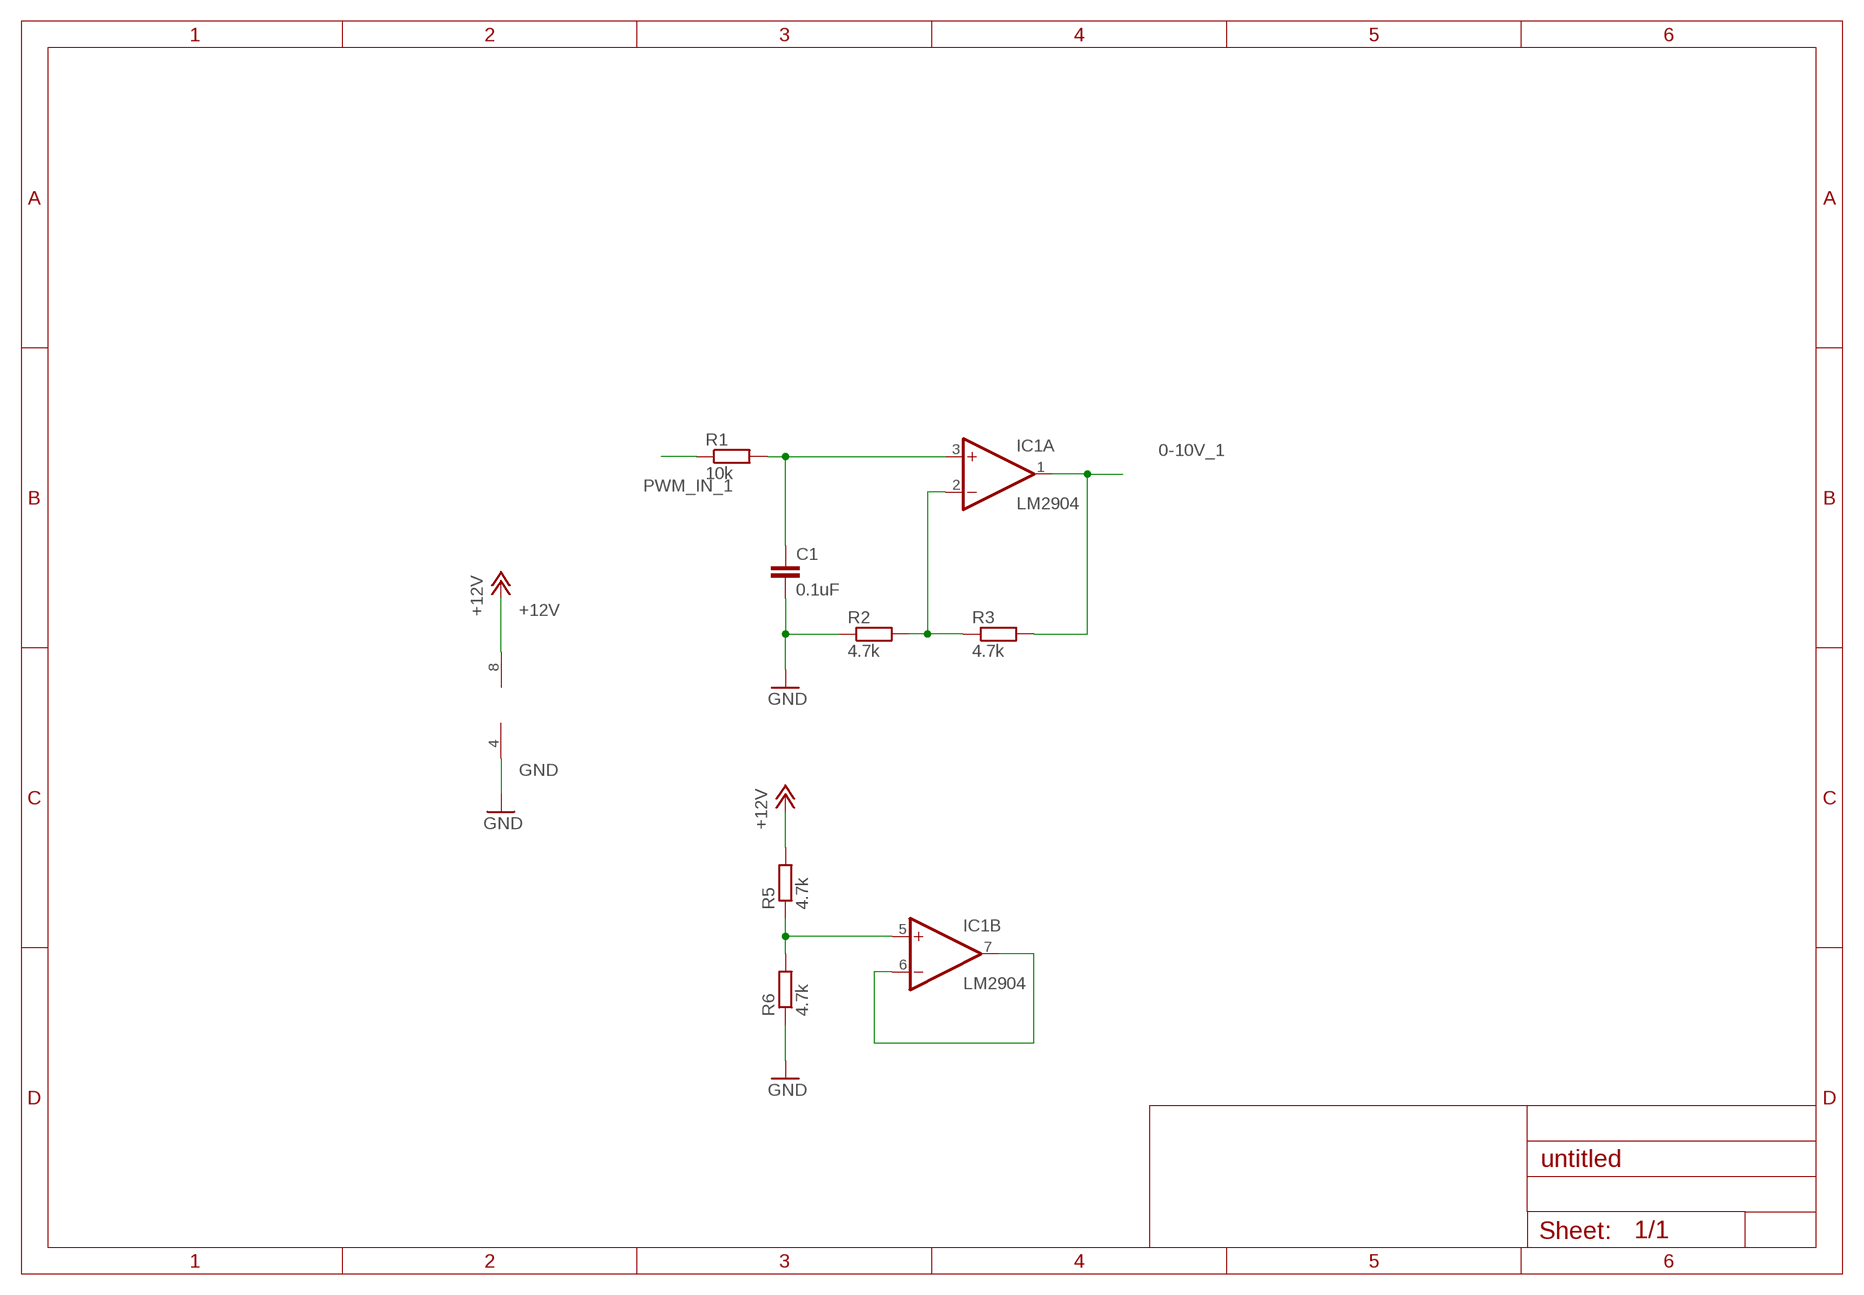
[diagram p6: schematic, module 0-10V, sheet 1]

### Parts
C1  0.1uF  C-EUC0603  [C0603]
IC1  LM2904  LM358D  [SO08]
R1  10k  R-EU_R0402  [R0402]
R2  4.7k  R-EU_R0402  [R0402]
R3  4.7k  R-EU_R0402  [R0402]
R5  4.7k  R-EU_R0402  [R0402]
R6  4.7k  R-EU_R0402  [R0402]

### Nets
0-10V_1: IC1.1(A:OUT) R3.2
+12V: IC1.8(P:V+) R5.2
GND: C1.2 IC1.4(P:V-) R2.1 R6.1
N$1: IC1.5(B:+IN) R5.1 R6.2
N$2: C1.1 IC1.3(A:+IN) R1.2
N$3: IC1.6(B:-IN) IC1.7(B:OUT)
N$4: IC1.2(A:-IN) R2.2 R3.1
PWM_IN_1: R1.1

### Library data of the parts
C1 = rcl:C-EU: CAPACITOR, European symbol; SPICEPREFIX: C
IC1 = linear:LM358: OP AMP also LM158; LM258; LM2904 Source: http://cache.national.com/ds/LM/LM158.pdf
R1-R3 R5 R6 = rcl:R-EU_: RESISTOR, European symbol; SPICEPREFIX: R

## Module RS485
Ports: 485R(io) 485D(out) 485REDE(in) RS485A(io) RS485B(io) +5V(pwr) GND(pwr)
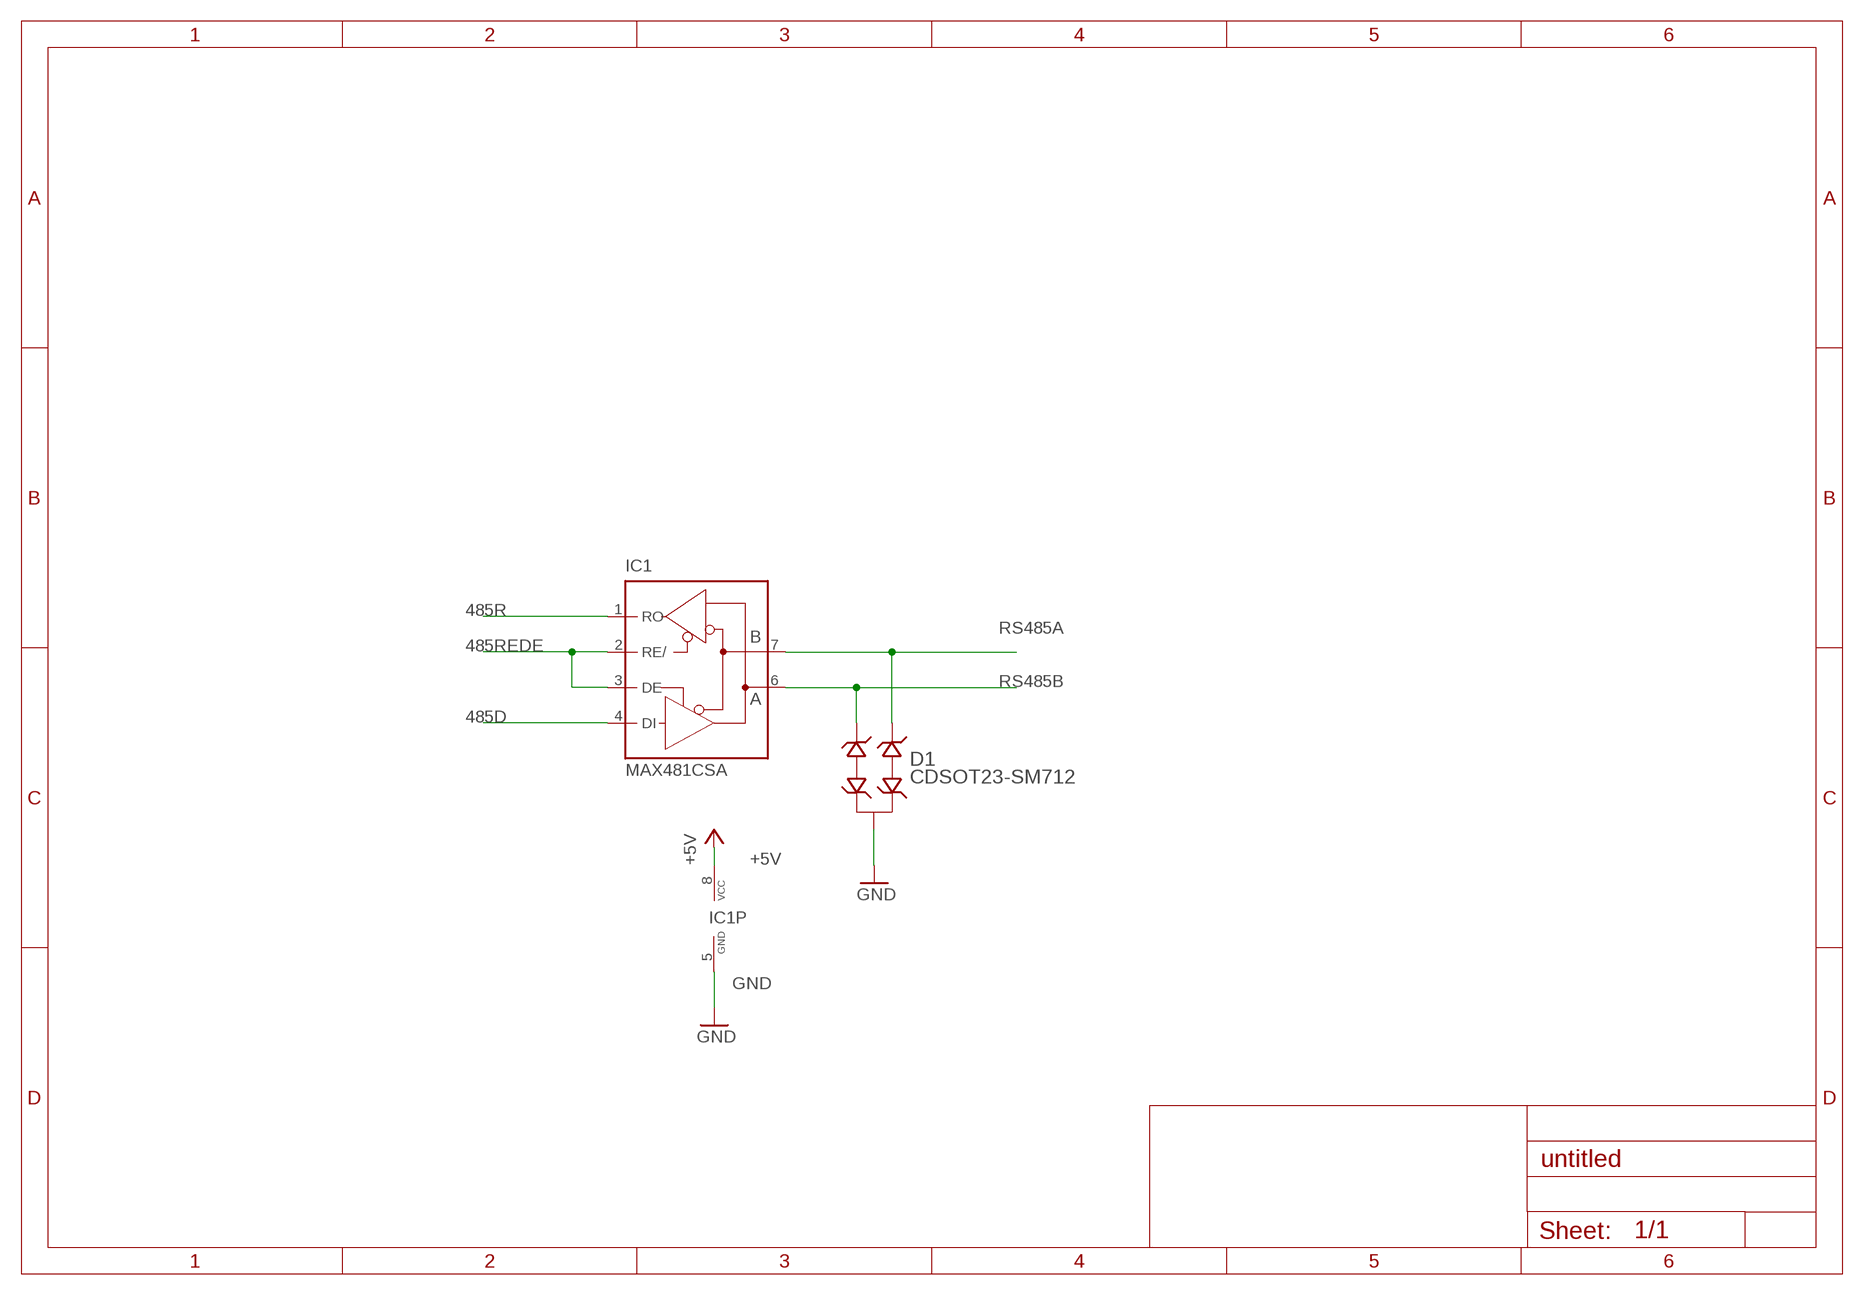
[diagram p7: schematic, module RS485, sheet 1]

### Parts
D1  CDSOT23-SM712  [SOT-23-3]
IC1  MAX481CSA  [SO08]

### Nets
485D: IC1.4(DI)
485R: IC1.1(RO)
485REDE: IC1.2(RE/) IC1.3(DE)
+5V: IC1.8(VCC)
GND: D1.3(GND) IC1.5(GND)
RS485A: D1.2(IO2) IC1.7(B)
RS485B: D1.1(IO1) IC1.6(A)

### Library data of the parts
D1 = CDSOT23-SM712:CDSOT23-SM712: Bourns CDSOT23-SM712 http://www.bourns.com/docs/Product-Datasheets/CDSOT23-SM712.pdf TVS Protection Didoe for RS-485 as recommended by TI in their RS-485 Reference Guide: http://www.ti.com/lit/sg/slyt484a/slyt484a.pdf; AVAILABILITY: Unavailable; DESCRIPTION: Diode, Smt Tvs Array, 7vrwm & 12vrwm, Sot23 Package; MF: Bourns; MP: CDSOT23-SM712; PACKAGE: SOT-23 Bourns; PRICE: None
IC1 = maxim:MAX481CSA: RS485 TRANSEIVER; MF: MAXIM; MPN: MAX481CSA; OC_FARNELL: unknown; OC_NEWARK: 90C3817

## Net classes
0 default: width 0.254 mm, drill 0.5 mm, clearance 0.203 mm
1 hipower: width 3 mm, drill 1 mm, clearance 0.254 mm
2 power: width 0.508 mm, drill 0.013 mm, clearance 0.203 mm